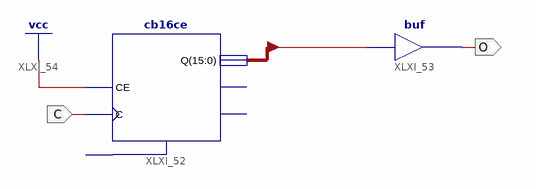
[diagram p0: schematic sheet 1]
// Xilinx ISE schematic ClkD2p16.sch (spartan3e) as structural Verilog: 2 symbols, 2 ports
module ClkD2p16 (
  input  C,
  output O
);

  wire [15:0] D;

  cb16ce XLXI_52 (.C(C), .CE(1'b1), .Q(D));  // open: CLR, CEO, TC
  buf XLXI_53 (O, D[15]);
endmodule
